# Altium project USB2AER.PRJPCB
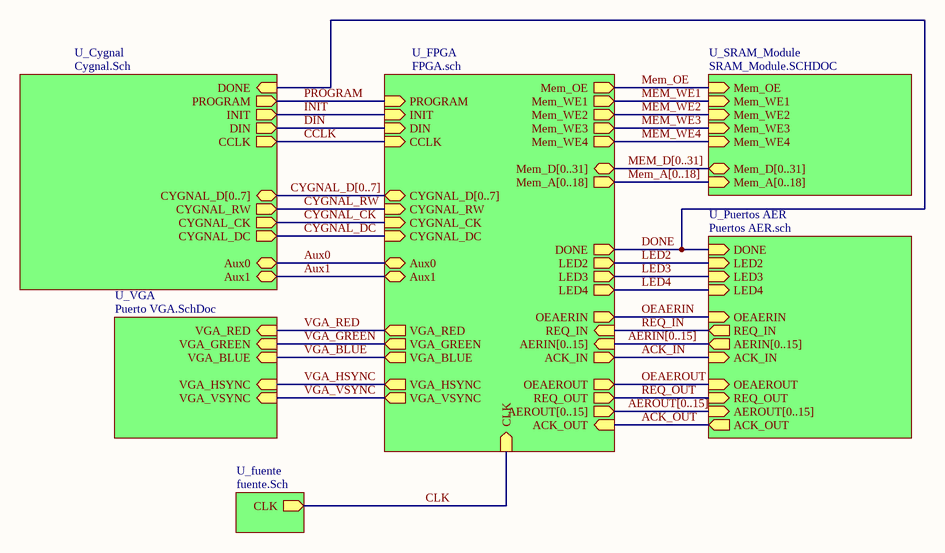
[diagram p0: Principal.SCHDOC]
3 sheets, 12 parts. Net scope: hierarchical (ports join the sheet entries above them; power ports are global).
Board files: USB2aer_def.PCBDOC, USB2AER1.PcbDoc
Sheets:
  Principal.SCHDOC
    U_SRAM_Module = SRAM_Module.SCHDOC
    U_VGA = Puerto VGA.SchDoc

## Sheet Principal.SCHDOC
size A4

### Sub-sheets
U_Cygnal = Cygnal.Sch (file not in this document): CYGNAL_D[0..7] (bidir), CYGNAL_RW (out), PROGRAM (out), INIT (out), CYGNAL_CK (out), CYGNAL_DC (out), DIN (out), CCLK (out), DONE (in), Aux0 (bidir), Aux1 (bidir)
U_FPGA = FPGA.sch (file not in this document): ACK_IN (out), REQ_IN (in), REQ_OUT (out), ACK_OUT (in), OEAEROUT (out), LED2 (out), LED3 (out), LED4 (out), PROGRAM (in), AERIN[0..15] (in), AEROUT[0..15] (out), CLK (in), INIT (in), OEAERIN (out), Mem_WE1 (out), Mem_OE (out), CYGNAL_D[0..7] (bidir), Mem_WE2 (out), Mem_WE3 (out), Mem_WE4 (out), CYGNAL_RW (in), CYGNAL_CK (in), CYGNAL_DC (in), Mem_D[0..31] (bidir), Mem_A[0..18] (out), CCLK (in), DONE (out), DIN (in), Aux0 (bidir), Aux1 (bidir), VGA_RED (out), VGA_GREEN (out), VGA_HSYNC (out), VGA_VSYNC (out), VGA_BLUE (out)
U_fuente = fuente.Sch (file not in this document): CLK (out)
U_Puertos AER = Puertos AER.sch (file not in this document): AERIN[0..15] (out), AEROUT[0..15] (in), DONE (in), LED2 (in), LED3 (in), LED4 (in), OEAERIN (in), OEAEROUT (in), ACK_IN (in), REQ_OUT (in), REQ_IN (out), ACK_OUT (out)
U_SRAM_Module = SRAM_Module.SCHDOC: Mem_WE1 (in), Mem_OE (in), Mem_A[0..18] (in), Mem_D[0..31] (bidir), Mem_WE2 (in), Mem_WE3 (in), Mem_WE4 (in)
U_VGA = Puerto VGA.SchDoc: VGA_HSYNC (in), VGA_RED (in), VGA_VSYNC (in), VGA_GREEN (in), VGA_BLUE (in)

### Nets
ACK_IN: sheet U_FPGA/ACK_IN, sheet U_Puertos AER/ACK_IN
ACK_OUT: sheet U_FPGA/ACK_OUT, sheet U_Puertos AER/ACK_OUT
Aux0: sheet U_Cygnal/Aux0, sheet U_FPGA/Aux0
Aux1: sheet U_Cygnal/Aux1, sheet U_FPGA/Aux1
CCLK: sheet U_Cygnal/CCLK, sheet U_FPGA/CCLK
CLK: sheet U_FPGA/CLK, sheet U_fuente/CLK
CYGNAL_CK: sheet U_Cygnal/CYGNAL_CK, sheet U_FPGA/CYGNAL_CK
CYGNAL_DC: sheet U_Cygnal/CYGNAL_DC, sheet U_FPGA/CYGNAL_DC
CYGNAL_RW: sheet U_Cygnal/CYGNAL_RW, sheet U_FPGA/CYGNAL_RW
DIN: sheet U_Cygnal/DIN, sheet U_FPGA/DIN
DONE: sheet U_Cygnal/DONE, sheet U_FPGA/DONE, sheet U_Puertos AER/DONE
INIT: sheet U_Cygnal/INIT, sheet U_FPGA/INIT
LED2: sheet U_FPGA/LED2, sheet U_Puertos AER/LED2
LED3: sheet U_FPGA/LED3, sheet U_Puertos AER/LED3
LED4: sheet U_FPGA/LED4, sheet U_Puertos AER/LED4
Mem_OE: sheet U_FPGA/Mem_OE, sheet U_SRAM_Module/Mem_OE
MEM_WE1: sheet U_FPGA/Mem_WE1, sheet U_SRAM_Module/Mem_WE1
MEM_WE2: sheet U_FPGA/Mem_WE2, sheet U_SRAM_Module/Mem_WE2
MEM_WE3: sheet U_FPGA/Mem_WE3, sheet U_SRAM_Module/Mem_WE3
MEM_WE4: sheet U_FPGA/Mem_WE4, sheet U_SRAM_Module/Mem_WE4
OEAERIN: sheet U_FPGA/OEAERIN, sheet U_Puertos AER/OEAERIN
OEAEROUT: sheet U_FPGA/OEAEROUT, sheet U_Puertos AER/OEAEROUT
PROGRAM: sheet U_Cygnal/PROGRAM, sheet U_FPGA/PROGRAM
REQ_IN: sheet U_FPGA/REQ_IN, sheet U_Puertos AER/REQ_IN
REQ_OUT: sheet U_FPGA/REQ_OUT, sheet U_Puertos AER/REQ_OUT
VGA_BLUE: sheet U_FPGA/VGA_BLUE, sheet U_VGA/VGA_BLUE
VGA_GREEN: sheet U_FPGA/VGA_GREEN, sheet U_VGA/VGA_GREEN
VGA_HSYNC: sheet U_FPGA/VGA_HSYNC, sheet U_VGA/VGA_HSYNC
VGA_RED: sheet U_FPGA/VGA_RED, sheet U_VGA/VGA_RED
VGA_VSYNC: sheet U_FPGA/VGA_VSYNC, sheet U_VGA/VGA_VSYNC

### Buses and harness runs
bus AERIN[0..15] = sheet U_FPGA/AERIN[0..15] = sheet U_Puertos AER/AERIN[0..15]
bus AEROUT[0..15] = sheet U_FPGA/AEROUT[0..15] = sheet U_Puertos AER/AEROUT[0..15]
bus CYGNAL_D[0..7] = sheet U_Cygnal/CYGNAL_D[0..7] = sheet U_FPGA/CYGNAL_D[0..7]
bus Mem_A[0..18] = sheet U_FPGA/Mem_A[0..18] = sheet U_SRAM_Module/Mem_A[0..18]
bus MEM_D[0..31] = sheet U_FPGA/Mem_D[0..31] = sheet U_SRAM_Module/Mem_D[0..31]

## Sheet SRAM_Module.SCHDOC
size B; SheetNumber: 2; SheetTotal: 7
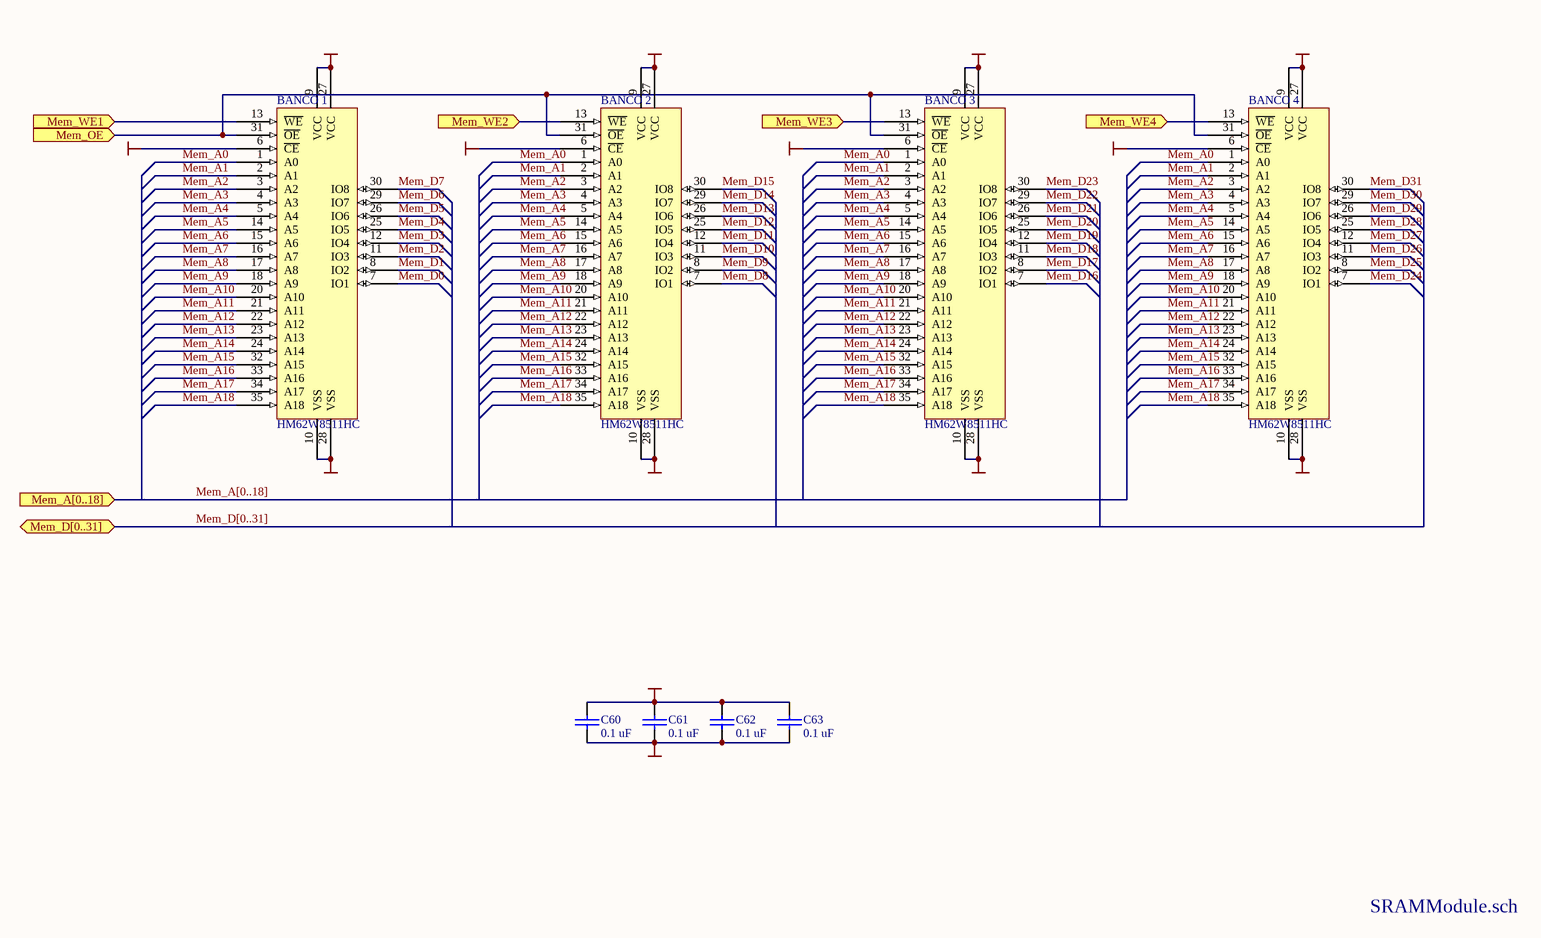
[diagram p1: SRAM_Module.SCHDOC]

### Parts
BANCO_1  HM62W8511HC  [SOJ36/400]
BANCO_2  HM62W8511HC  [SOJ36/400]
BANCO_3  HM62W8511HC  [SOJ36/400]
BANCO_4  HM62W8511HC  [SOJ36/400]
C60  0.1 uF  [CAP 10]
C61  0.1 uF  [CAP 10]
C62  0.1 uF  [CAP 10]
C63  0.1 uF  [CAP 10]

### Ports
Mem_A[0..18] (in), Mem_D[0..31] (bidir), Mem_OE (in), Mem_WE1 (in), Mem_WE2 (in), Mem_WE3 (in), Mem_WE4 (in)

### Nets
GND: BANCO_1.6(~{CE}) BANCO_1.10(VSS) BANCO_1.28(VSS) BANCO_2.6(~{CE}) BANCO_2.10(VSS) BANCO_2.28(VSS) BANCO_3.6(~{CE}) BANCO_3.10(VSS) BANCO_3.28(VSS) BANCO_4.6(~{CE}) BANCO_4.10(VSS) BANCO_4.28(VSS) C60.2 C61.2 C62.2 C63.2  [also labelled VSS]
VCC: BANCO_1.9(VCC) BANCO_1.27(VCC) BANCO_2.9(VCC) BANCO_2.27(VCC) BANCO_3.9(VCC) BANCO_3.27(VCC) BANCO_4.9(VCC) BANCO_4.27(VCC) C60.1 C61.1 C62.1 C63.1  [also labelled VCC_3.3V]
Mem_A0: BANCO_1.1(A0) BANCO_2.1(A0) BANCO_3.1(A0) BANCO_4.1(A0)
Mem_A1: BANCO_1.2(A1) BANCO_2.2(A1) BANCO_3.2(A1) BANCO_4.2(A1)
Mem_A2: BANCO_1.3(A2) BANCO_2.3(A2) BANCO_3.3(A2) BANCO_4.3(A2)
Mem_A3: BANCO_1.4(A3) BANCO_2.4(A3) BANCO_3.4(A3) BANCO_4.4(A3)
Mem_A4: BANCO_1.5(A4) BANCO_2.5(A4) BANCO_3.5(A4) BANCO_4.5(A4)
Mem_A5: BANCO_1.14(A5) BANCO_2.14(A5) BANCO_3.14(A5) BANCO_4.14(A5)
Mem_A6: BANCO_1.15(A6) BANCO_2.15(A6) BANCO_3.15(A6) BANCO_4.15(A6)
Mem_A7: BANCO_1.16(A7) BANCO_2.16(A7) BANCO_3.16(A7) BANCO_4.16(A7)
Mem_A8: BANCO_1.17(A8) BANCO_2.17(A8) BANCO_3.17(A8) BANCO_4.17(A8)
Mem_A9: BANCO_1.18(A9) BANCO_2.18(A9) BANCO_3.18(A9) BANCO_4.18(A9)
Mem_A10: BANCO_1.20(A10) BANCO_2.20(A10) BANCO_3.20(A10) BANCO_4.20(A10)
Mem_A11: BANCO_1.21(A11) BANCO_2.21(A11) BANCO_3.21(A11) BANCO_4.21(A11)
Mem_A12: BANCO_1.22(A12) BANCO_2.22(A12) BANCO_3.22(A12) BANCO_4.22(A12)
Mem_A13: BANCO_1.23(A13) BANCO_2.23(A13) BANCO_3.23(A13) BANCO_4.23(A13)
Mem_A14: BANCO_1.24(A14) BANCO_2.24(A14) BANCO_3.24(A14) BANCO_4.24(A14)
Mem_A15: BANCO_1.32(A15) BANCO_2.32(A15) BANCO_3.32(A15) BANCO_4.32(A15)
Mem_A16: BANCO_1.33(A16) BANCO_2.33(A16) BANCO_3.33(A16) BANCO_4.33(A16)
Mem_A17: BANCO_1.34(A17) BANCO_2.34(A17) BANCO_3.34(A17) BANCO_4.34(A17)
Mem_A18: BANCO_1.35(A18) BANCO_2.35(A18) BANCO_3.35(A18) BANCO_4.35(A18)
Mem_D0: BANCO_1.7(IO1)
Mem_D1: BANCO_1.8(IO2)
Mem_D2: BANCO_1.11(IO3)
Mem_D3: BANCO_1.12(IO4)
Mem_D4: BANCO_1.25(IO5)
Mem_D5: BANCO_1.26(IO6)
Mem_D6: BANCO_1.29(IO7)
Mem_D7: BANCO_1.30(IO8)
Mem_D8: BANCO_2.7(IO1)
Mem_D9: BANCO_2.8(IO2)
Mem_D10: BANCO_2.11(IO3)
Mem_D11: BANCO_2.12(IO4)
Mem_D12: BANCO_2.25(IO5)
Mem_D13: BANCO_2.26(IO6)
Mem_D14: BANCO_2.29(IO7)
Mem_D15: BANCO_2.30(IO8)
Mem_D16: BANCO_3.7(IO1)
Mem_D17: BANCO_3.8(IO2)
Mem_D18: BANCO_3.11(IO3)
Mem_D19: BANCO_3.12(IO4)
Mem_D20: BANCO_3.25(IO5)
Mem_D21: BANCO_3.26(IO6)
Mem_D22: BANCO_3.29(IO7)
Mem_D23: BANCO_3.30(IO8)
Mem_D24: BANCO_4.7(IO1)
Mem_D25: BANCO_4.8(IO2)
Mem_D26: BANCO_4.11(IO3)
Mem_D27: BANCO_4.12(IO4)
Mem_D28: BANCO_4.25(IO5)
Mem_D29: BANCO_4.26(IO6)
Mem_D30: BANCO_4.29(IO7)
Mem_D31: BANCO_4.30(IO8)
Mem_OE: BANCO_1.31(~{OE}) BANCO_2.31(~{OE}) BANCO_3.31(~{OE}) BANCO_4.31(~{OE}) ; port Mem_OE
MEM_WE1: BANCO_1.13(~{WE}) ; port Mem_WE1
MEM_WE2: BANCO_2.13(~{WE}) ; port Mem_WE2
MEM_WE3: BANCO_3.13(~{WE}) ; port Mem_WE3
MEM_WE4: BANCO_4.13(~{WE}) ; port Mem_WE4

### Buses and harness runs
bus Mem_A[0..18] = port Mem_A[0..18]
bus Mem_D[0..31] = port Mem_D[0..31]

### Notes on the sheet
- SRAMModule.sch

### Library data of the parts
C60-C63 = CAP: Capacitor

## Sheet Puerto VGA.SchDoc
size B
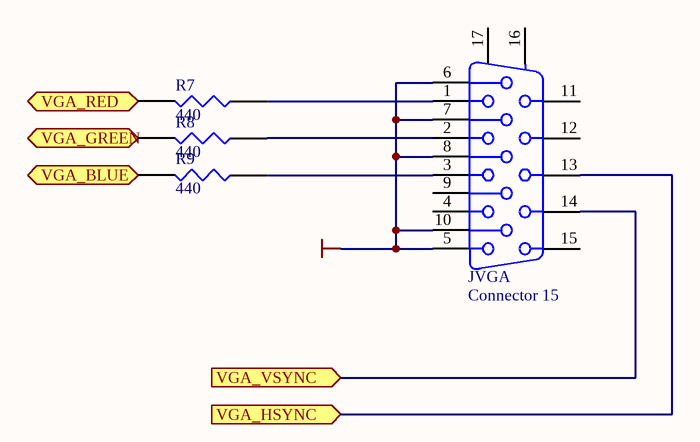
[diagram p2: Puerto VGA.SchDoc]

### Parts
JVGA  Connector 15  [VGACON]
R7  440  [AXIAL-0.4]
R8  440  [AXIAL-0.4]
R9  440  [AXIAL-0.4]

### Ports
VGA_BLUE (in), VGA_GREEN (in), VGA_HSYNC (in), VGA_RED (in), VGA_VSYNC (in)

### Nets
GND: JVGA.5 JVGA.6 JVGA.7 JVGA.8 JVGA.10
VGA_BLUE: R9.2 ; port VGA_BLUE
VGA_GREEN: R8.2 ; port VGA_GREEN
VGA_HSYNC: JVGA.13 ; port VGA_HSYNC
VGA_RED: R7.2 ; port VGA_RED
VGA_VSYNC: JVGA.14 ; port VGA_VSYNC
NetJVGA_1: JVGA.1 R7.1
NetJVGA_2: JVGA.2 R8.1
NetJVGA_3: JVGA.3 R9.1

Not connected (* = marked no-connect by the designer): JVGA 4 9 11 12 15 16(MH1) 17(MH2)

### Library data of the parts
JVGA = Connector 15: Receptacle Assembly, 15-Pin Connector; Manufacturer: Generic Components; Positions: 15; Gender: Receptacle Header; Published: 15/06/2001; Publisher: Altium Hobart Technology Centre; Class: Connector; Orientation: Right Angle
R7-R9 = RES1

## Nets that join several sheets
GND: SRAM_Module (16 pins), Puerto VGA (5 pins)